# EAGLE design Uncertainty Device (EAGLE 9.6.2)

## Sheet 1 of 2
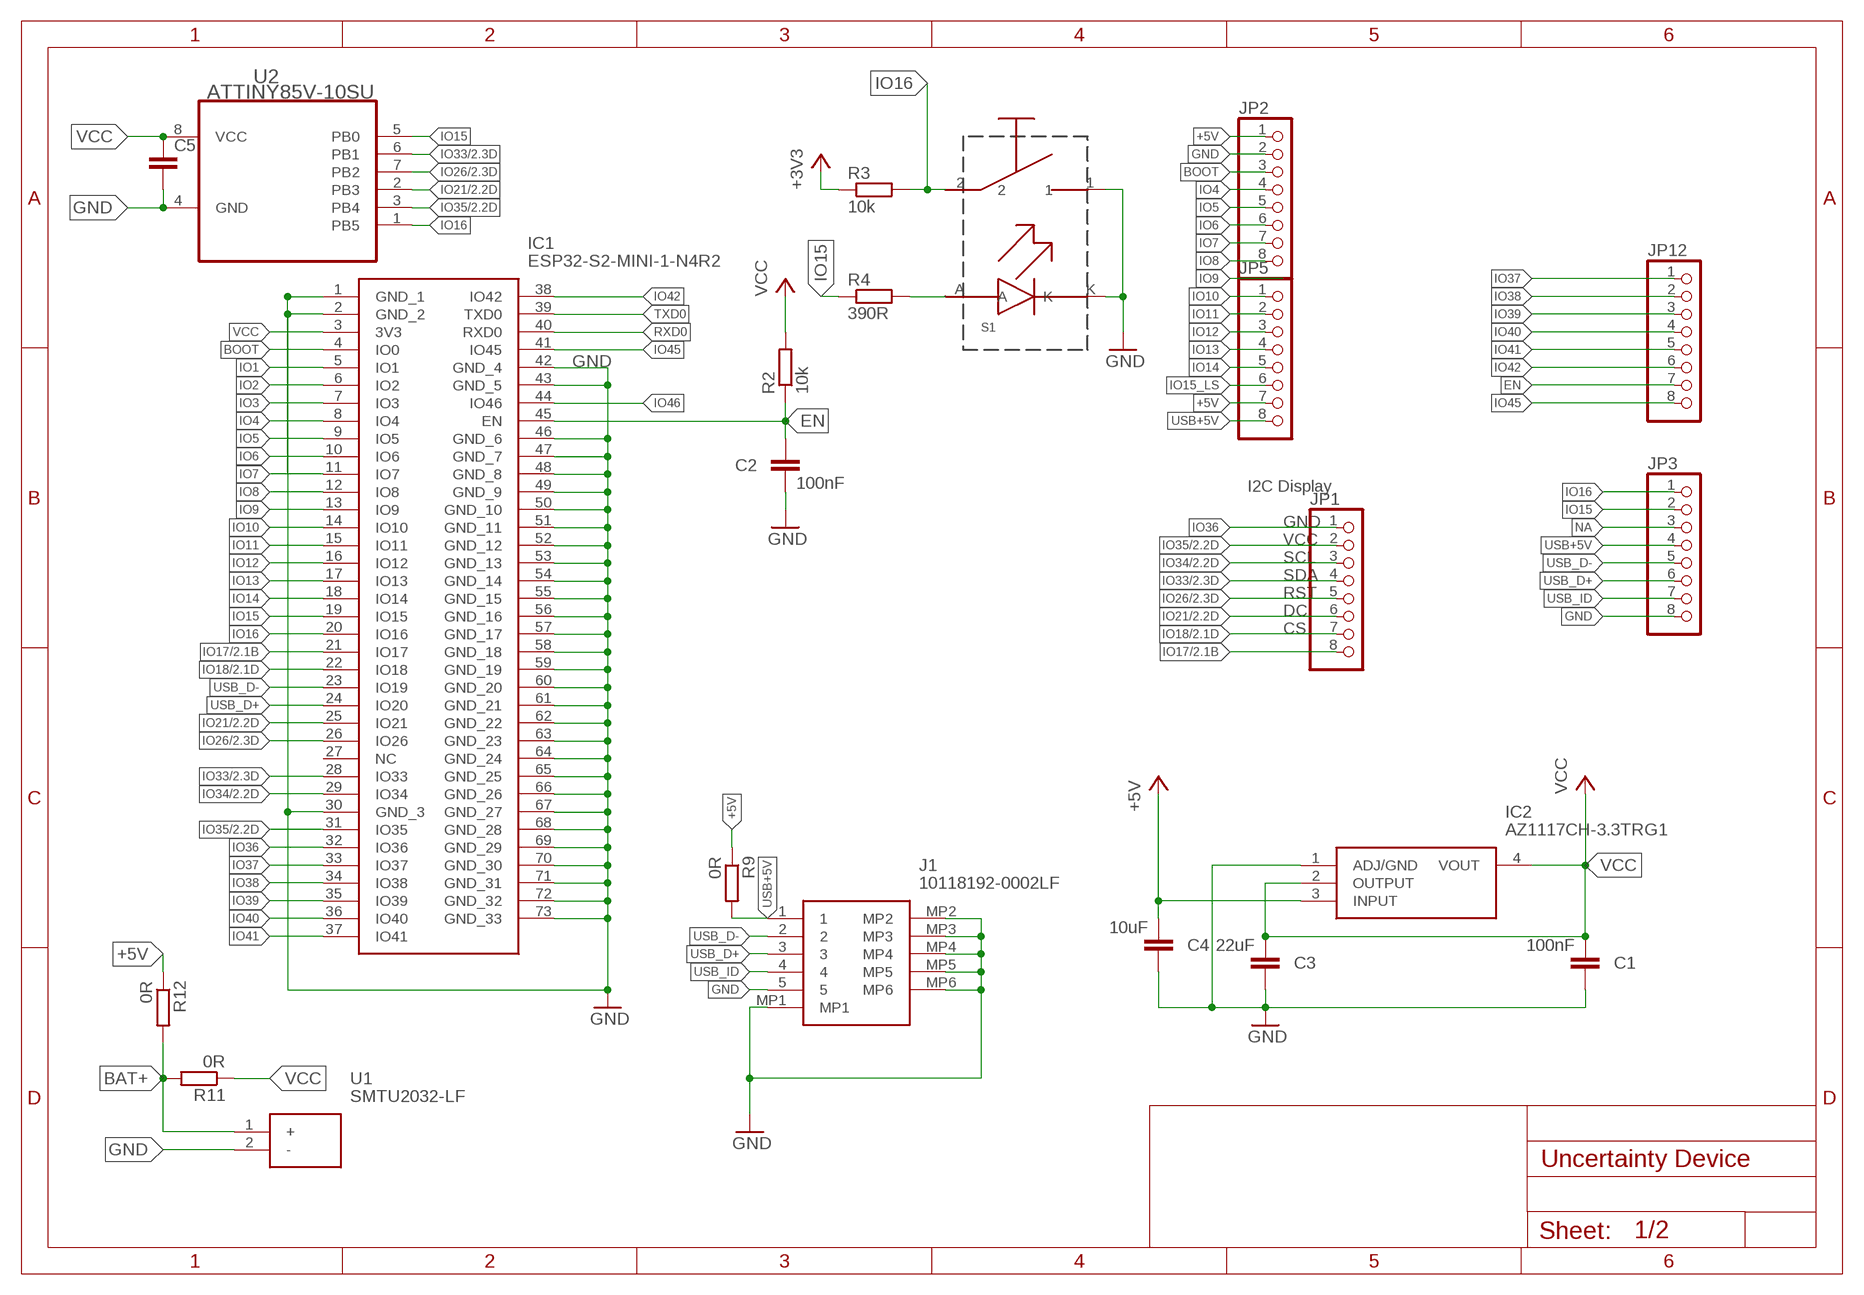
[diagram p0: schematic, sheet 1]

### Parts
C1  100nF  C-EUC0805  [C0805]
C2  100nF  C-EUC0805  [C0805]
C3  22uF  C-EUC0805  [C0805]
C4  10uF  C-EUC0805  [C0805]
C5  C-EUC0805  [C0805]
IC1  ESP32-S2-MINI-1-N4R2  [ESP32S2MINI1N4R2]
IC2  AZ1117CH-3.3TRG1  [SOT230P700X180-4N]
J1  10118192-0002LF  [101181920002LF]
JP1  PINHD-1X8  [1X08]
JP2  PINHD-1X8  [1X08]
JP3  PINHD-1X8  [1X08]
JP5  PINHD-1X8  [1X08]
JP12  PINHD-1X8  [1X08]
R2  10k  R-EU_R0805  [R0805]
R3  10k  R-EU_R0805  [R0805]
R4  390R  R-EU_R0805  [R0805]
R9  0R  R-EU_R0805  [R0805]
R11  0R  R-EU_R0805  [R0805]
R12  0R  R-EU_R0805  [R0805]
S1  3006SMD  [SMD]
U1  SMTU2032-LF  [SMTU2032LF]
U2  ATTINY85V-10SU  [SOIC127P798X216-8N]

### Nets
+3V3: R3.1
+5V: C4.2 IC2.3(INPUT) JP2.1 JP5.7 R9.1 R12.1
BAT+: R11.2 R12.2 U1.1(+)
BOOT: IC1.4(IO0) JP2.3
EN: C2.1 IC1.45(EN) JP12.7 R2.1
GND: C1.1 C2.2 C3.1 C4.1 C5.2 IC1.1(GND_1) IC1.2(GND_2) IC1.30(GND_3) IC1.42(GND_4) IC1.43(GND_5) IC1.46(GND_6) IC1.47(GND_7) IC1.48(GND_8) IC1.49(GND_9) IC1.50(GND_10) IC1.51(GND_11) IC1.52(GND_12) IC1.53(GND_13) IC1.54(GND_14) IC1.55(GND_15) IC1.56(GND_16) IC1.57(GND_17) IC1.58(GND_18) IC1.59(GND_19) IC1.60(GND_20) IC1.61(GND_21) IC1.62(GND_22) IC1.63(GND_23) IC1.64(GND_24) IC1.65(GND_25) IC1.66(GND_26) IC1.67(GND_27) IC1.68(GND_28) IC1.69(GND_29) IC1.70(GND_30) IC1.71(GND_31) IC1.72(GND_32) IC1.73(GND_33) IC2.1(ADJ/GND) J1.5 J1.MP1 J1.MP2 J1.MP3 J1.MP4 J1.MP5 J1.MP6 JP2.2 JP3.8 S1.1 S1.K U1.2(-) U2.4(GND) ; also sheet 2
IO1: IC1.5(IO1)
IO2: IC1.6(IO2)
IO3: IC1.7(IO3)
IO4: IC1.8(IO4) JP2.4
IO5: IC1.9(IO5) JP2.5
IO6: IC1.10(IO6) JP2.6
IO7: IC1.11(IO7) JP2.7
IO8: IC1.12(IO8) JP2.8
IO9: IC1.13(IO9)
IO10: IC1.14(IO10) JP5.1
IO11: IC1.15(IO11) JP5.2
IO12: IC1.16(IO12) JP5.3
IO13: IC1.17(IO13) JP5.4
IO14: IC1.18(IO14) JP5.5
IO15: IC1.19(IO15) JP3.2 R4.1 U2.5(PB0)
IO15_LS: JP5.6
IO16: IC1.20(IO16) JP3.1 R3.2 S1.2 U2.1(PB5)
IO17: IC1.21(IO17) JP1.8 ; also sheet 2
IO18: IC1.22(IO18) JP1.7 ; also sheet 2
IO21: IC1.25(IO21) JP1.6 U2.2(PB3) ; also sheet 2
IO26: IC1.26(IO26) JP1.5 U2.7(PB2) ; also sheet 2
IO33: IC1.28(IO33) JP1.4 U2.6(PB1) ; also sheet 2
IO34: IC1.29(IO34) JP1.3 ; also sheet 2
IO35: IC1.31(IO35) JP1.2 U2.3(PB4) ; also sheet 2
IO36: IC1.32(IO36) JP1.1
IO37: IC1.33(IO37) JP12.1
IO38: IC1.34(IO38) JP12.2
IO39: IC1.35(IO39) JP12.3
IO40: IC1.36(IO40) JP12.4
IO41: IC1.37(IO41) JP12.5
IO42: IC1.38(IO42) JP12.6
IO45: IC1.41(IO45) JP12.8
IO46: IC1.44(IO46)
N$5: R4.2 S1.A
NA: JP3.3
RXD0: IC1.40(RXD0)
TXD0: IC1.39(TXD0)
USB+5V: J1.1 JP3.4 JP5.8 R9.2
USB_D+: IC1.24(IO20) J1.3 JP3.6
USB_D-: IC1.23(IO19) J1.2 JP3.5
USB_ID: J1.4 JP3.7
VCC: C1.2 C3.2 C5.1 IC1.3(3V3) IC2.2(OUTPUT) IC2.4(VOUT) R2.2 R11.1 U2.8(VCC)
Unconnected: IC1.27(NC)

### Notes on the sheet
- I2C Display
- GND
- VCC
- SCL
- SDA
- RST
- DC
- CS

## Sheet 2 of 2
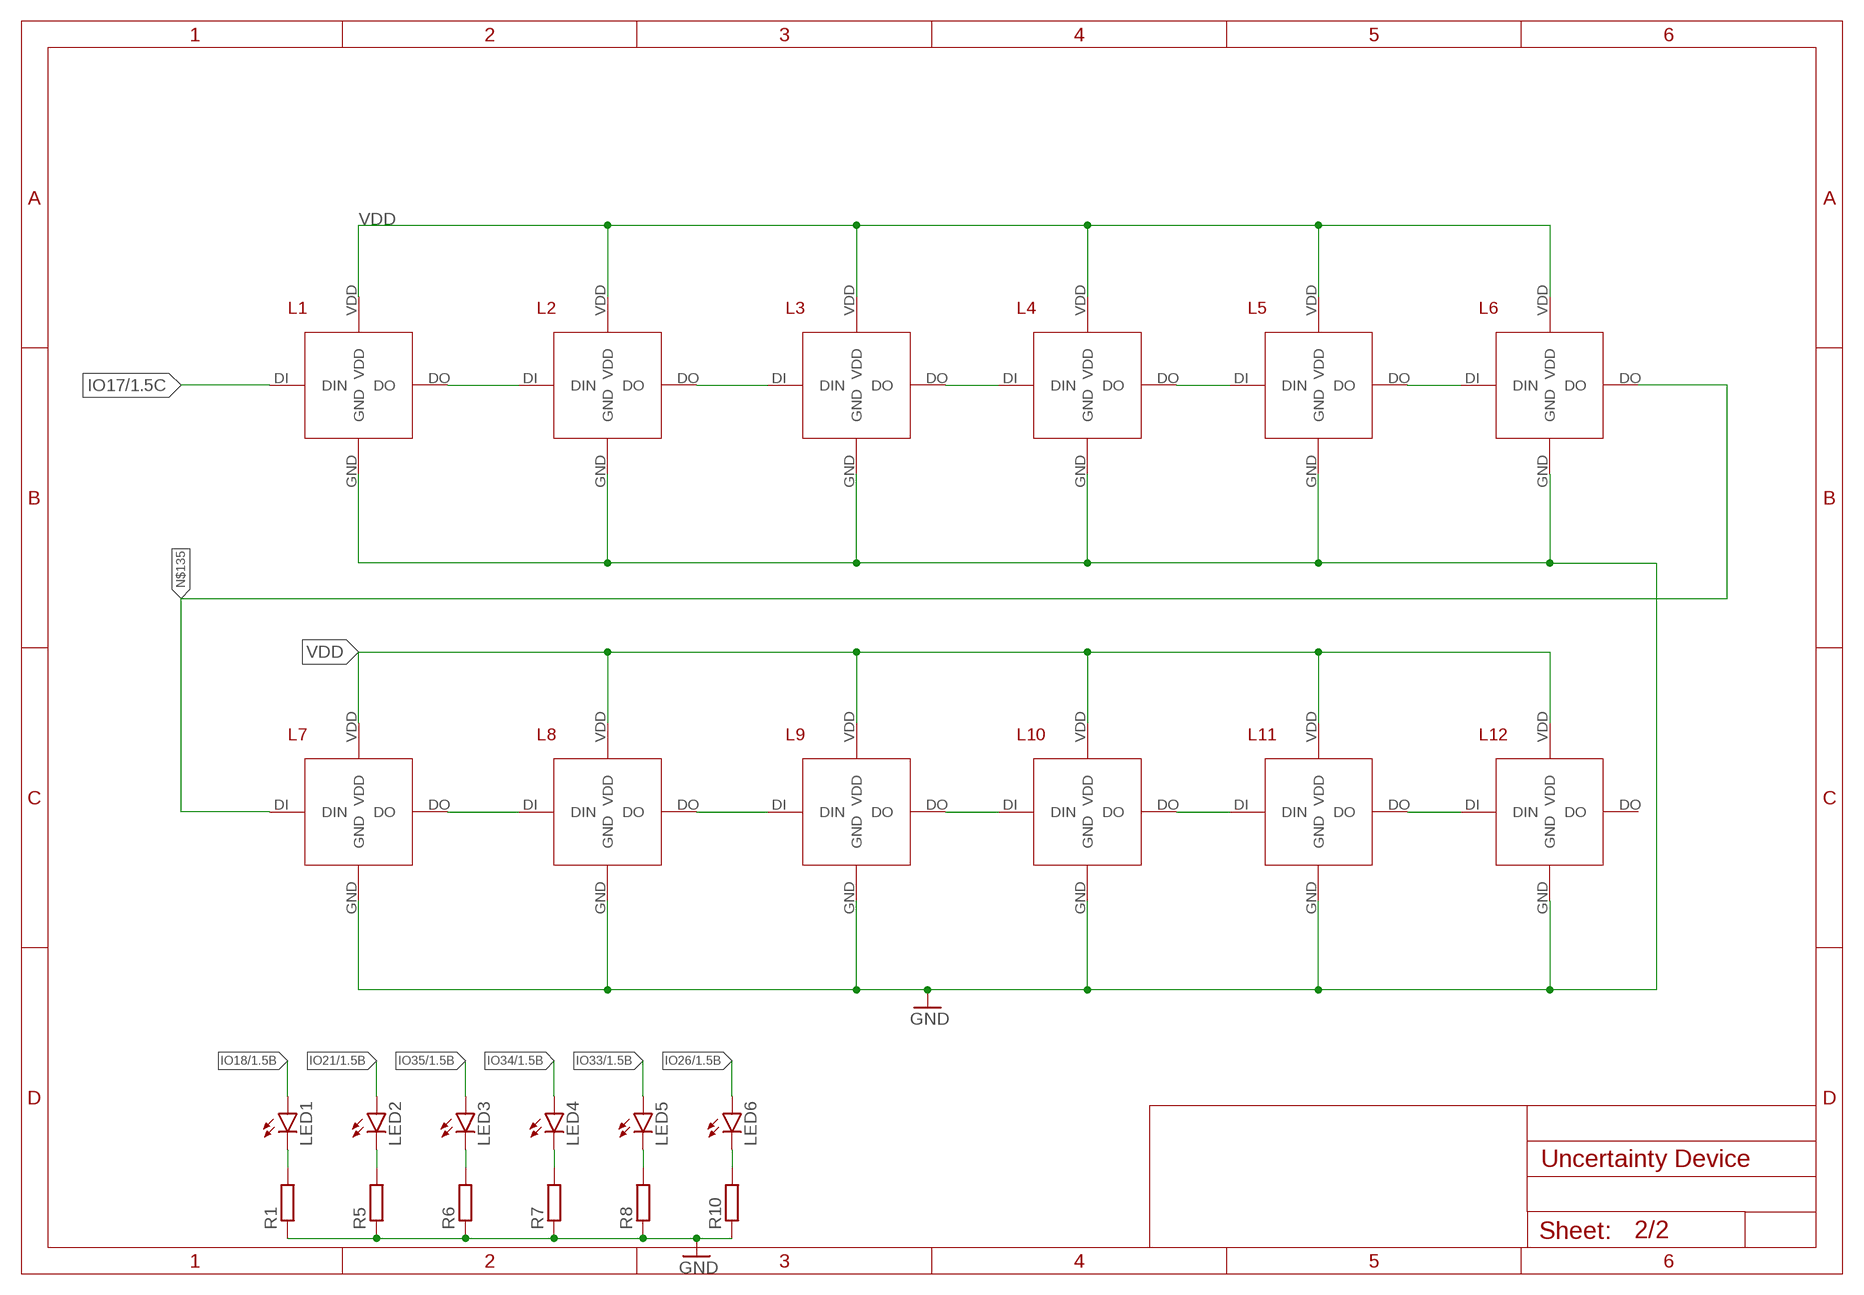
[diagram p1: schematic, sheet 2]

### Parts
L1  XL-1615RGBC  [XL-1615RGBC-WS2812]
L2  XL-1615RGBC  [XL-1615RGBC-WS2812]
L3  XL-1615RGBC  [XL-1615RGBC-WS2812]
L4  XL-1615RGBC  [XL-1615RGBC-WS2812]
L5  XL-1615RGBC  [XL-1615RGBC-WS2812]
L6  XL-1615RGBC  [XL-1615RGBC-WS2812]
L7  XL-1615RGBC  [XL-1615RGBC-WS2812]
L8  XL-1615RGBC  [XL-1615RGBC-WS2812]
L9  XL-1615RGBC  [XL-1615RGBC-WS2812]
L10  XL-1615RGBC  [XL-1615RGBC-WS2812]
L11  XL-1615RGBC  [XL-1615RGBC-WS2812]
L12  XL-1615RGBC  [XL-1615RGBC-WS2812]
LED1  LEDCHIPLED_0805  [CHIPLED_0805]
LED2  LEDCHIPLED_0805  [CHIPLED_0805]
LED3  LEDCHIPLED_0805  [CHIPLED_0805]
LED4  LEDCHIPLED_0805  [CHIPLED_0805]
LED5  LEDCHIPLED_0805  [CHIPLED_0805]
LED6  LEDCHIPLED_0805  [CHIPLED_0805]
R1  R-EU_R0805  [R0805]
R5  R-EU_R0805  [R0805]
R6  R-EU_R0805  [R0805]
R7  R-EU_R0805  [R0805]
R8  R-EU_R0805  [R0805]
R10  R-EU_R0805  [R0805]

### Nets
GND: L1.GND L2.GND L3.GND L4.GND L5.GND L6.GND L7.GND L8.GND L9.GND L10.GND L11.GND L12.GND R1.1 R5.1 R6.1 R7.1 R8.1 R10.1 ; also sheet 1
IO17: L1.DI(DIN) ; also sheet 1
IO18: LED1.A ; also sheet 1
IO21: LED2.A ; also sheet 1
IO26: LED6.A ; also sheet 1
IO33: LED5.A ; also sheet 1
IO34: LED4.A ; also sheet 1
IO35: LED3.A ; also sheet 1
N$3: LED1.C R1.2
N$8: L1.DO L2.DI(DIN)
N$9: L2.DO L3.DI(DIN)
N$10: L3.DO L4.DI(DIN)
N$11: L4.DO L5.DI(DIN)
N$12: L5.DO L6.DI(DIN)
N$16: L7.DO L8.DI(DIN)
N$17: L8.DO L9.DI(DIN)
N$18: L9.DO L10.DI(DIN)
N$19: L10.DO L11.DI(DIN)
N$20: L11.DO L12.DI(DIN)
N$21: LED2.C R5.2
N$22: LED3.C R6.2
N$23: LED4.C R7.2
N$24: LED5.C R8.2
N$25: LED6.C R10.2
N$135: L6.DO L7.DI(DIN)
VDD: L1.VDD L2.VDD L3.VDD L4.VDD L5.VDD L6.VDD L7.VDD L8.VDD L9.VDD L10.VDD L11.VDD L12.VDD
Unconnected: L12.DO

## Library data of the parts
C1-C4 = rcl:C-EU: CAPACITOR, European symbol; SPICEPREFIX: C
C5 = resistor:C-EU: CAPACITOR, European symbol
IC1 = ESP32-S2-MINI-1-N4R2:ESP32-S2-MINI-1-N4R2: WiFi Modules - 802.11 SMD module, ESP32-S2FN4R2 with 4 MB flash die and 2 MB PSRAM die inside, PCB antenna Source: Datasheet; DESCRIPTION: WiFi Modules - 802.11 SMD module, ESP32-S2FN4R2 with 4 MB flash die and 2 MB PSRAM die inside, PCB antenna; HEIGHT: mm; MANUFACTURER_NAME: Espressif Systems; MANUFACTURER_PART_NUMBER: ESP32-S2-MINI-1-N4R2; MOUSER_PART_NUMBER: 356-ESP32S2MINI1N4R2; MOUSER_PRICE-STOCK: https://www.mouser.co.uk/ProductDetail/Espressif-Systems/ESP32-S2-MINI-1-N4R2?qs=iLbezkQI%252Bsgb61FCBnw%252B9A%3D%3D
IC2 = AZ1117CH-3.3TRG1:AZ1117CH-3.3TRG1: 1.35A 3.3V LDO Reg. Current Limit SOT223 DiodesZetex AZ1117CH-3.3TRG1, LDO Voltage Regulator, 0.8A, 3.3 V +/-1%, maximum of 15 Vin, 3-Pin SOT-223 Source: Datasheet <https://www.diodes.com//assets/Datasheets/AZ1117C.pdf>; DESCRIPTION: 1.35A 3.3V LDO Reg. Current Limit SOT223 DiodesZetex AZ1117CH-3.3TRG1, LDO Voltage Regulator, 0.8A, 3.3 V +/-1%, maximum of 15 Vin, 3-Pin SOT-223; HEIGHT: 1.8mm; MANUFACTURER_NAME: Diodes Incorporated; MANUFACTURER_PART_NUMBER: AZ1117CH-3.3TRG1; MOUSER_PART_NUMBER: 621-AZ1117CH-3.3TRG1; MOUSER_PRICE-STOCK: https://www.mouser.co.uk/ProductDetail/Diodes-Incorporated/AZ1117CH-3.3TRG1?qs=FKu9oBikfSm7ntaG6olPSQ%3D%3D
J1 = 10118192-0002LF:10118192-0002LF: Micro USB 2.0, Input Output Connectors, B TYPE RECEPTACLE without flange Source: Datasheet <https://cdn.amphenol-cs.com/media/wysiwyg/files/drawing/10118192.pdf>; DESCRIPTION: Micro USB 2.0, Input Output Connectors, B TYPE RECEPTACLE without flange; HEIGHT: 3.08mm; MANUFACTURER_NAME: Amphenol Communications Solutions; MANUFACTURER_PART_NUMBER: 10118192-0002LF
JP1-JP3 JP5 JP12 = pinhead:PINHD-1X8: PIN HEADER
L1-L12 = Xinglight:XL-1615RGBC
LED1-LED6 = led:LED: LED OSRAM: - CHIPLED LG R971, LG N971, LY N971, LG Q971, LY Q971, LO R971, LY R971 LH N974, LH R974 LS Q976, LO Q976, LY Q976 LO Q996 - Hyper CHIPLED LW Q18S LB Q993, LB Q99A, LB R99A - SideLED LS A670, LO A670, LY A670, LG A670, LP A670 LB A673, LV A673, LT A673, LW A673 LH A674 LY A675 LS A676, LA A676, LO A676, LY A676, LW A676 LS A679, LY A679, LG A679 - Hyper Micro SIDELED® LS Y876, LA Y876, LO Y876, LY Y876 LT Y87S - SmartLED LW L88C, LW L88S LB L89C, LB L89S, LG L890 LS L89K, LO L89K, LY L89K LS L896, LA L896, LO L896, LY L896 - TOPLED LS T670, LO T670, LY T670, LG T670, LP T670 LSG T670, LSP T670, LSY T670, LOP T670, LYG T670 LG T671, LOG T671, LSG T671 LB T673, LV T673, LT T673, LW T673 LH T674 LS T676, LA T676, LO T676, LY T676, LB T676, LH T676, LSB T676, LW T676 LB T67C, LV T67C, LT T67C, LS T67K, LO T67K, LY T67K, LW E67C LS E67B, LA E67B, LO E67B, LY E67B, LB E67C, LV E67C, LT E67C LW T67C LS T679, LY T679, LG T679 LS T770, LO T770, LY T770, LG T770, LP T770 LB T773, LV T773, LT T773, LW T773 LH T774 LS E675, LA E675, LY E675, LS T675 LS T776, LA T776, LO T776, LY T776, LB T776 LHGB T686 LT T68C, LB T68C - Hyper Mini TOPLED® LB M676 - Mini TOPLED Santana® LG M470 LS M47K, LO M47K, LY M47K Source: http://www.osram.convergy.de LUXEON: - LUMILED® LXK2-PW12-R00, LXK2-PW12-S00, LXK2-PW14-U00, LXK2-PW14-V00 LXK2-PM12-R00, LXK2-PM12-S00, LXK2-PM14-U00 LXK2-PE12-Q00, LXK2-PE12-R00, LXK2-PE12-S00, LXK2-PE14-T00, LXK2-PE14-U00 LXK2-PB12-K00, LXK2-PB12-L00, LXK2-PB12-M00, LXK2-PB14-N00, LXK2-PB14-P00, LXK2-PB14-Q00 LXK2-PR12-L00, LXK2-PR12-M00, LXK2-PR14-Q00, LXK2-PR14-R00 LXK2-PD12-Q00, LXK2-PD12-R00, LXK2-PD12-S00 LXK2-PH12-R00, LXK2-PH12-S00 LXK2-PL12-P00, LXK2-PL12-Q00, LXK2-PL12-R00 Source: www.luxeon.com KINGBRIGHT: KA-3528ASYC Source: www.kingbright.com
R1-R12 = rcl:R-EU_: RESISTOR, European symbol; SPICEPREFIX: R
S1 = smd:3006SMD
U1 = SMTU2032-LF:SMTU2032-LF: Coin Cell Battery Holders SFC MNT FOR CR2032 Source: Datasheet <https://componentsearchengine.com/Datasheets/1/SMTU2032-LF.pdf>; DESCRIPTION: Coin Cell Battery Holders SFC MNT FOR CR2032; HEIGHT: 5mm; MANUFACTURER_NAME: RENATA; MANUFACTURER_PART_NUMBER: SMTU2032-LF; MOUSER_PART_NUMBER: 614-SMTU2032-LF; MOUSER_PRICE-STOCK: https://www.mouser.co.uk/ProductDetail/Renata/SMTU2032-LF?qs=r1PAtlylphCLeXbokB9Tog%3D%3D
U2 = Attiny85V:ATTINY85V-10SU: 8-bit Microcontroller with In-System Programmable Flash; MPN: ATTINY85V-10SU; OC_FARNELL: 1455166; OC_NEWARK: 68T3816; PACKAGE: SOIC-8; SUPPLIER: Atmel

## Board
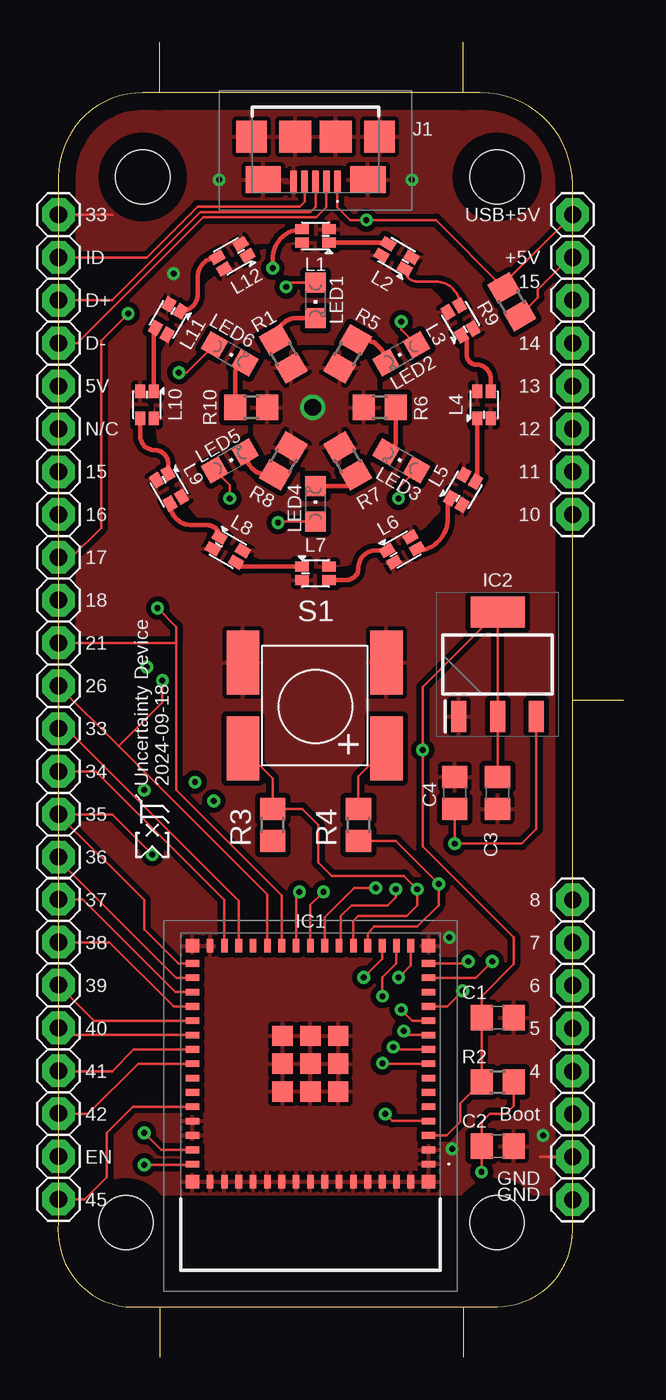
[diagram p2: board, top side]
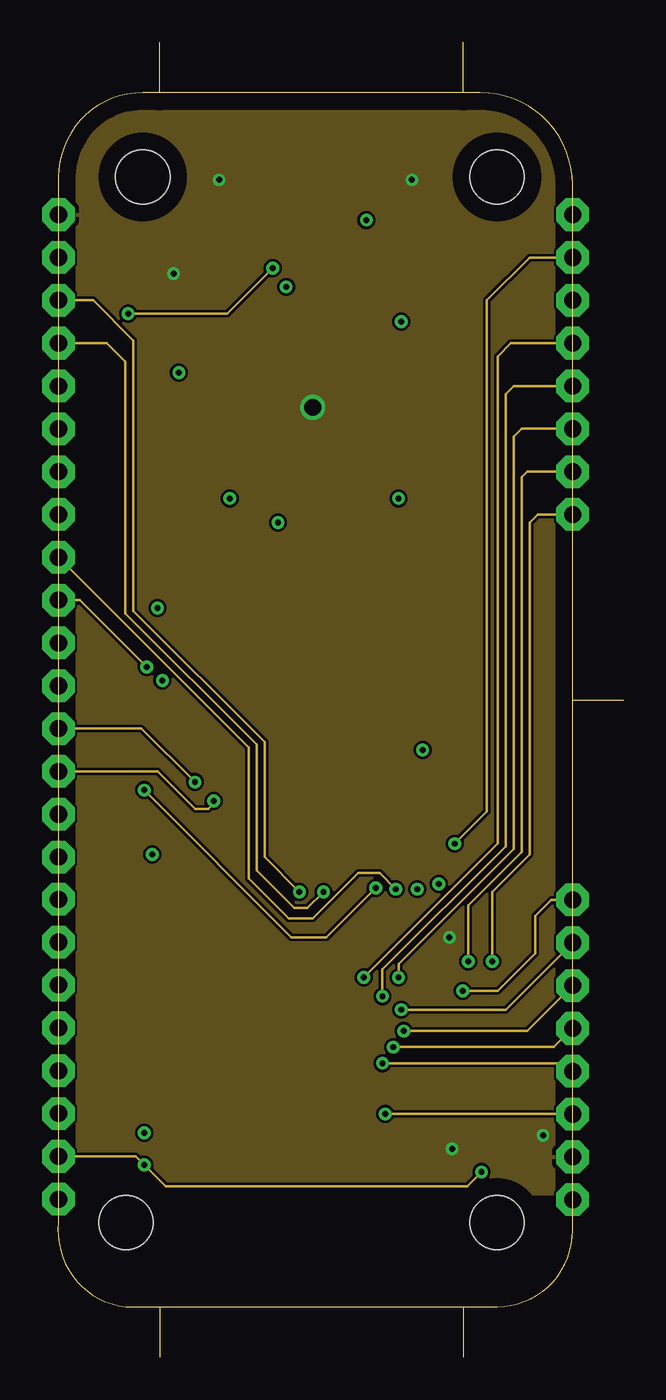
[diagram p3: board, inner layer Route2]
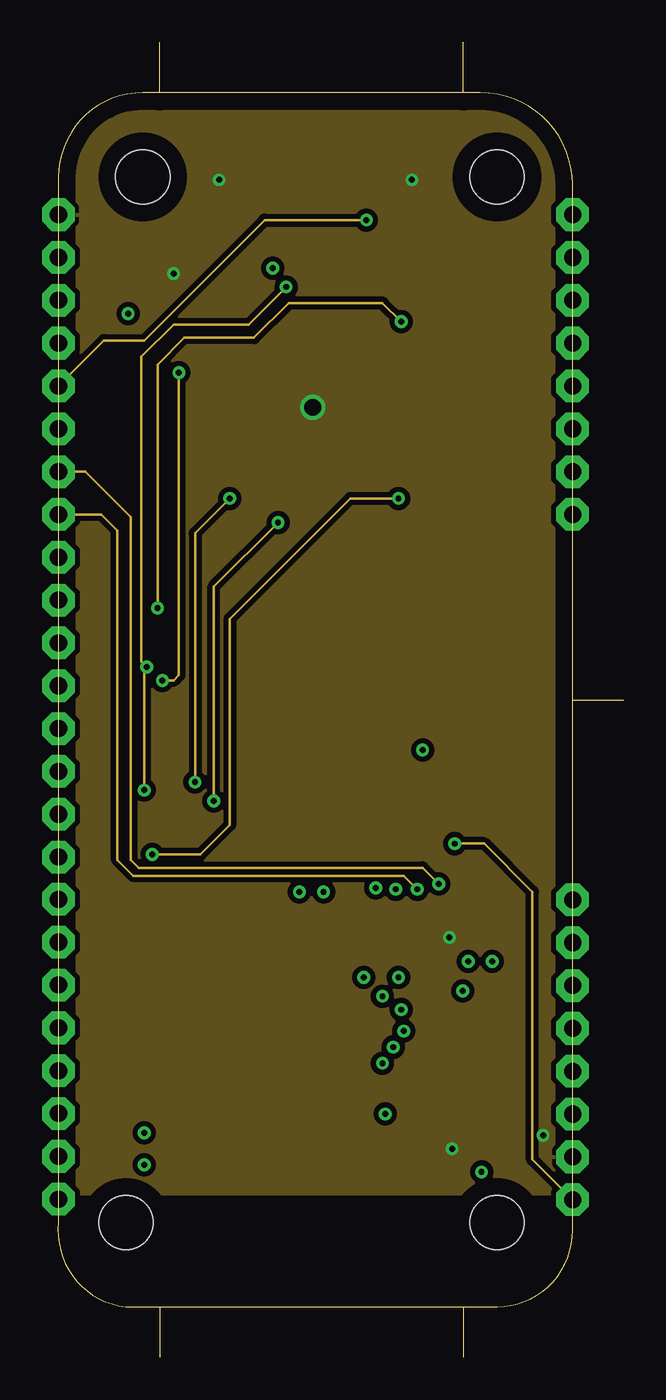
[diagram p4: board, inner layer Route15]
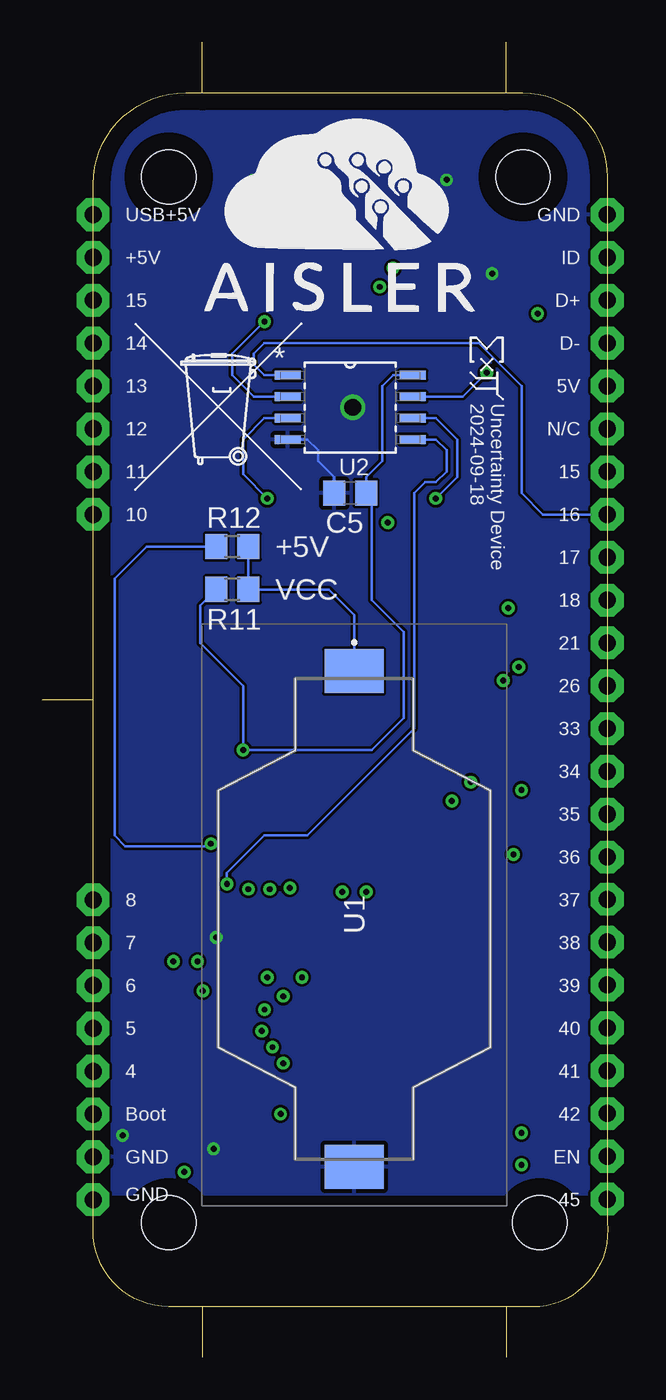
[diagram p5: board, bottom side, seen from below]

Size 33.53 x 78 mm. Coordinates in mm from the lower left corner, seen from the top.
Outline: 6.03,3 4.03,3 arc-90 0.03,8 0.03,70 arc-90 5.03,75 6.03,75
Outline: 6.03,3 24.03,3
Outline: 24.03,3 26.03,3 arc90 30.51,7.54 30.51,69.58 arc90 25.03,75 24.03,75
Outline: 24.03,75 6.03,75
Outline: 6.03,75 6.03,78
Outline: 24.03,75 24.03,78
Outline: 6.03,3 6.03,0
Outline: 24.03,3 24.03,0
Outline: 30.53,39 33.53,39
Copper layers (1+2*15+16): Top 0.04mm / dielectric 0.138mm / Route2 0.035mm / dielectric 0.36mm / Route15 0.035mm / dielectric 0.138mm / Bottom 0.04mm
Design rules "default *": minimum track width 6mil, minimum drill 0.35mm, track to track 6mil, track to pad 6mil, pad to pad 6mil, via to via 6mil, smd to smd 6mil, copper to edge 40mil, drill to drill 6mil, minimum pad ring 10mil, minimum via ring 8mil, stop-mask expansion 0mil, vias tented up to drill 14mil, thermal gap 10mil
Holes 3.2 mm at 26.03,8 4.03,8 5.03,70 26.03,70
tKeepout: area 2,67 to 8,73; area 23,67 to 29,73

### Footprints (pad centres in the part's own frame; a part is rotated, then mirrored left to right if it is on the bottom)
C0805 = smd 1.3 x 1.5: 1 -0.95,0; 2 0.95,0
ESP32S2MINI1N4R2 = smd 0.8 x 0.4: 1 -7,5.95; 2 -7,5.1; 3 -7,4.25; 4 -7,3.4; 5 -7,2.55; 6 -7,1.7; 7 -7,0.85; 8 -7,0; 9 -7,-0.85; 10 -7,-1.7; 11 -7,-2.55; 12 -7,-3.4; 13 -7,-4.25; 14 -7,-5.1; 15 -7,-5.95; 31 7,-5.95; 32 7,-5.1; 33 7,-4.25; 34 7,-3.4; 35 7,-2.55; 36 7,-1.7; 37 7,-0.85; 38 7,0; 39 7,0.85; 40 7,1.7; 41 7,2.55; 42 7,3.4; 43 7,4.25; 44 7,5.1; 45 7,5.95 | smd 0.4 x 0.8: 16 -5.95,-7; 17 -5.1,-7; 18 -4.25,-7; 19 -3.4,-7; 20 -2.55,-7; 21 -1.7,-7; 22 -0.85,-7; 23 0,-7; 24 0.85,-7; 25 1.7,-7; 26 2.55,-7; 27 3.4,-7; 28 4.25,-7; 29 5.1,-7; 30 5.95,-7; 46 5.95,7; 47 5.1,7; 48 4.25,7; 49 3.4,7; 50 2.55,7; 51 1.7,7; 52 0.85,7; 53 0,7; 54 -0.85,7; 55 -1.7,7; 56 -2.55,7; 57 -3.4,7; 58 -4.25,7; 59 -5.1,7; 60 -5.95,7 | smd 1.2 x 1.2: 61 0,0; 66 -1.65,1.65; 67 -1.65,0; 68 -1.65,-1.65; 69 0,-1.65; 70 1.65,-1.65; 71 1.65,0; 72 1.65,1.65; 73 0,1.65 | smd 0.8 x 0.8: 62 -7,7; 63 -7,-7; 64 7,-7; 65 7,7
SOT230P700X180-4N = smd 1.85 x 0.9: 1 -3.1,2.3; 2 -3.1,0; 3 -3.1,-2.3 | smd 1.85 x 3.2: 4 3.1,0
101181920002LF = smd 0.4 x 1.35: 1 -1.3,1.875; 2 -0.65,1.875; 3 0,1.875; 4 0.65,1.875; 5 1.3,1.875 | smd 2.1 x 1.6: MP1 -3.1,1.75; MP2 3.1,1.75 | smd 1.8 x 1.9: MP3 -3.8,-0.8; MP6 3.8,-0.8 | smd 1.9 x 1.9: MP4 -1.2,-0.8; MP5 1.2,-0.8
1X08 = drill 1.016 pad 1.93 octagon: 1 -8.89,0; 2 -6.35,0; 3 -3.81,0; 4 -1.27,0; 5 1.27,0; 6 3.81,0; 7 6.35,0; 8 8.89,0
XL-1615RGBC-WS2812 = smd 0.8 x 0.6: DI 0.8,-0.4; DO -0.8,0.4; GND -0.8,-0.4; VDD 0.8,0.4
CHIPLED_0805 = smd 1.2 x 1.2: A 0,-1.05; C 0,1.05
R0805 = smd 1.3 x 1.5: 1 -0.95,0; 2 0.95,0
SMD = smd 3.81 x 1.93: 1 2.644,-4.199; 2 -2.456,4.301; A -2.456,-4.199; K 2.644,4.301
SMTU2032LF = smd 2.6 x 3.5: 1 -14.7,0; 2 14.7,0
SOIC127P798X216-8N = smd 1.549 x 0.533: 1 -3.708,1.905; 2 -3.708,0.635; 3 -3.708,-0.635; 4 -3.708,-1.905; 5 3.708,-1.905; 6 3.708,-0.635; 7 3.708,0.635; 8 3.708,1.905

### Placement (x,y rotation side)
C1  26.06,20.14 180 top
C2  26.06,12.53 0 top
C3  26.06,33.48 90 top
C4  23.52,33.48 270 top
C5  15.27,51.26 180 bottom
IC1  14.97,17.41 180 top
IC2  26.06,41.1 90 top
J1  15.27,71.58 180 top
JP1  0.03,38.56 90 top
JP2  30.51,18.24 90 top
JP3  0.03,58.88 90 top
JP5  30.51,58.88 90 top
JP12  0.03,18.27 270 top
L1  15.27,66.5 180 top
L2  20.07,65.3 150 top
L3  23.87,61.5 120 top
L4  25.27,56.5 90 top
L5  24.02,51.45 60 top
L6  20.41,47.91 30 top
L7  15.27,46.5 0 top
L8  10.07,47.9 330 top
L9  6.59,51.53 300 top
L10  5.27,56.5 270 top
L11  6.53,61.55 240 top
L12  10.34,65.29 210 top
LED1  15.27,62.69 180 top
LED2  20.35,59.52 120 top
LED3  20.35,53.16 60 top
LED4  15.27,50.62 0 top
LED5  10.19,53.16 300 top
LED6  10.19,59.52 240 top
R1  13.36,59.52 120 top
R2  26.06,16.34 180 top
R3  12.73,31.57 90 top
R4  17.81,31.57 90 top
R5  17.17,59.52 60 top
R6  19.08,56.34 0 top
R7  17.17,53.16 300 top
R8  13.36,53.16 240 top
R9  26.89,62.6 120 top
R10  11.46,56.34 180 top
R11  22.25,45.55 0 bottom
R12  22.25,48.09 0 bottom
S1  15.27,38.56 90 top
U1  15.03,26 270 bottom
U2  15.27,56.34 0 bottom
U$1  [AISLER]  16.19,66.68 0 bottom
U$3  [TONNE_10.00]  23.19,54.4 0 bottom

### Tracks (layer width: path | path; a pad name or v marks a point on that pad's centre or on a via)
+5V  (via drill 0.35)
  Top 0.152: R9.1 28.44,62.85 28.44,63.33 30.35,65.23 JP5.7 | IC2.3 28.36,31.34 27.49,30.46 v23.52,30.46 C4.2
  Route2 0.152: JP5.7 27.97,65.23 25.43,62.69 25.43,32.37 v23.52,30.46
  Route15 0.152: JP2.1 28.13,11.73 28.13,27.61 25.27,30.46 v23.52,30.46
  Bottom 0.152: R12.1 27.33,48.09 29.24,46.18 29.24,30.94 28.6,30.3 23.68,30.3 v23.52,30.46
BAT+
  Bottom 0.152: R12.2 R11.2 16.54,45.55 15.03,44.03 U1.1
BOOT  (via drill 0.35)
  Top 0.152: IC1.4 19.81,14.01 v19.39,14.43
  Route2 0.152: v19.39,14.43 JP2.3
EN  (via drill 0.35)
  Top 0.152: R2.1 27.01,14.91 26.54,14.43 25.59,14.43 25.11,13.96 C2.1 25.11,10.94 v25.11,10.99 | v5.11,11.41 7.92,11.41 IC1.45
  Route2 0.152: v25.11,10.99 24.26,10.14 6.38,10.14 v5.11,11.41 4.6,11.92 JP12.7
GND  (via drill 0.35, 1)
  Top 0.152: JP3.8 3.2,67.77 | JP2.2 28.6,11.89
  Bottom 0.152: U2.4 17.81,54.44 17.17,53.8 17.17,53.16 16.22,52.21 C5.2
  other vias: 15.11,56.34 6.85,64.28 9.55,69.83 20.98,69.83 23.36,12.37 28.76,13.16 23.2,24.91
  pour Top (isolate 0.305, rank 5): -0.13,9.68 -0.13,75.78 30.99,75.78 30.99,9.68
  pour Bottom: -0.13,9.68 -0.13,75.78 30.99,75.78 30.99,9.68
  pour Route2: -0.13,9.68 -0.13,75.78 30.99,75.78 30.99,9.68
  pour Top: 15.27,59.67 15.74,59.67 arc-90 19.08,56.34 arc-90 15.58,52.85 15.27,52.85 14.95,52.85 arc-90 11.46,56.34 arc-90 14.79,59.67
  pour Route15 (isolate 0.305): -0.13,9.68 -0.13,75.78 30.99,75.78 30.99,9.68
IO4  (via drill 0.35)
  Top 0.152: IC1.8 19.27,17.41 v19.24,17.45
  Route2 0.152: v19.24,17.45 30.03,17.45 JP2.4
IO5  (via drill 0.35)
  Top 0.152: IC1.9 20.01,18.26 v19.87,18.4
  Route2 0.152: v19.87,18.4 29.4,18.4 JP2.5
IO6  (via drill 0.35)
  Top 0.152: IC1.10 20.74,19.11 v20.51,19.35
  Route2 0.152: v20.51,19.35 27.81,19.35 JP2.6
IO7  (via drill 0.35)
  Top 0.152: IC1.11 21,19.96 v20.35,20.62
  Route2 0.152: v20.35,20.62 26.54,20.62 JP2.7
IO8  (via drill 0.35)
  Top 0.152: IC1.12 23.08,20.81 v24,21.73
  Route2 0.152: JP2.8 29.24,27.13 28.28,26.18 28.28,23.95 26.06,21.73 v24,21.73
IO10  (via drill 0.35)
  Top 0.152: IC1.14 24.78,22.51 v25.74,23.48
  Route2 0.152: v25.74,23.48 25.74,27.61 27.97,29.83 27.97,49.51 28.44,49.99 JP5.1
IO11  (via drill 0.35)
  Top 0.152: IC1.15 24.2,23.36 v24.32,23.48
  Route2 0.152: JP5.2 27.81,52.53 27.49,52.21 27.49,29.99 24.32,26.81 v24.32,23.48
IO12  (via drill 0.35)
  Top 0.152: IC1.16 20.92,23.25 v20.19,22.53
  Route2 0.152: v20.19,22.53 20.19,23.32 27.01,30.15 27.01,54.59 27.49,55.07 JP5.3
IO13  (via drill 0.35)
  Top 0.152: v19.24,21.41 19.24,22.53 20.07,23.36 IC1.17
  Route2 0.152: JP5.4 27.01,57.61 26.54,57.13 26.54,30.3 19.24,23 v19.24,21.41
IO14  (via drill 0.35)
  Top 0.152: IC1.18 19.22,23.62 v18.12,22.53
  Route2 0.152: v18.12,22.53 26.06,30.46 26.06,59.36 26.86,60.15 JP5.5
IO15  (via drill 0.35)
  Top 0.152: IC1.19 18.37,25.15 18.76,25.54 21.3,25.54 22.57,26.81 v22.57,28.08 20.03,30.62 R4.1
  Route15 0.152: JP3.2 1.61,52.53 4.31,49.83 4.31,29.51 4.79,29.04 21.62,29.04 v22.57,28.08
  Bottom 0.152: U2.5 10.19,54.44 9.55,53.8 9.55,52.53 10.19,51.9 10.82,51.9 11.46,51.26 11.46,37.29 17.81,30.94 20.35,30.94 22.57,28.72 v22.57,28.08
IO16  (via drill 0.35)
  Top 0.152: IC1.20 17.52,25.89 17.81,26.18 20.66,26.18 21.3,26.81 v21.3,27.77 20.51,28.56 16.22,28.56 15.43,29.35 15.43,31.57 14.48,32.52 R3.2 12.73,34.34 S1.2
  Route15 0.152: v21.3,27.77 20.51,28.56 4.47,28.56 3.52,29.51 3.52,49.04 2.57,49.99 JP3.1
  Bottom 0.152: JP3.1 3.84,49.99 5.11,51.26 5.11,57.61 7.65,60.15 20.35,60.15 20.98,59.52 20.98,58.88 20.35,58.24 U2.1
IO17  (via drill 0.35)
  Top 0.152: IC1.21 16.77,24.52 16.77,26.18 17.4,26.81 19.55,26.81 20.03,27.29 v20.03,27.77 | v4.15,61.9 2.57,60.31 2.57,49.2 0.82,47.45 JP1.8
  Top 0.254: L1.DI arc90 12.73,65.16 v12.73,64.59
  Route2 0.152: v20.03,27.77 19.08,28.72 17.81,28.72 15.11,26.02 13.68,26.02 11.3,28.4 11.3,36.18 JP1.8 | v12.73,64.59 10.03,61.9 v4.15,61.9
IO18  (via drill 0.35)
  Top 0.152: IC1.22 15.82,26.09 17.57,27.84 v18.84,27.84 | LED1.A 13.78,63.74 v13.52,63.48
  Route2 0.152: v18.84,27.84 15.9,24.91 13.84,24.91 v5.11,33.64 | v5.27,40.94 1.3,44.91 JP1.7
  Route15 0.152: v5.11,33.64 5.11,40.78 v5.27,40.94 4.95,41.26 4.95,59.36 6.85,61.26 11.3,61.26 v13.52,63.48
IO21  (via drill 0.35)
  Top 0.152: IC1.25 13.27,27.38 7.01,33.64 7.01,42.37 | 7.01,42.37 JP1.6 | LED2.A 20.35,60.95 v20.35,61.42 | v5.9,44.43 7.01,43.32 7.01,42.37
  Route15 0.152: v20.35,61.42 19.24,62.53 13.68,62.53 11.62,60.47 7.49,60.47 5.9,58.88 v5.9,44.43
  Bottom 0.152: U2.2 20.98,56.98 22.25,58.24 22.25,59.52 v20.35,61.42
IO26  (via drill 0.35)
  Top 0.152: IC1.26 12.42,27.44 3.6,36.26 | 3.6,36.26 JP1.5 | LED6.A 7.64,58.4 v7.17,58.4 | v6.19,40.15 6.19,38.85 3.6,36.26
  Route15 0.152: v7.17,58.4 7.17,40.47 6.85,40.15 v6.19,40.15
  Bottom 0.152: U2.7 8.6,56.98 v7.17,58.4
IO33  (via drill 0.35)
  Top 0.152: IC1.28 10.72,27.08 0.5,37.29 JP1.4 | LED5.A 10.19,51.73 v10.19,50.94
  Route2 0.152: JP1.4 4.95,37.29 v8.12,34.11
  Route15 0.152: v10.19,50.94 8.12,48.88 v8.12,34.11
  Bottom 0.152: U2.6 10.19,55.7 8.92,54.44 8.92,52.21 v10.19,50.94
IO34  (via drill 0.35)
  Top 0.152: IC1.29 9.87,27.13 2.25,34.75 JP1.3 | v13.04,49.51 13.11,49.58 LED4.A
  Route2 0.152: JP1.3 5.9,34.75 8.12,32.53 8.92,32.53 9.23,32.84 v9.23,33
  Route15 0.152: v9.23,33 9.23,45.7 v13.04,49.51
IO35  (via drill 0.35)
  Top 0.152: IC1.31 7.13,23.36 5.11,25.38 5.11,27.13 JP1.2 3.2,32.21 v5.58,29.83 | LED3.A 20.19,51.57 v20.19,50.94
  Route15 0.152: v20.19,50.94 17.33,50.94 10.19,43.8 10.19,31.57 8.44,29.83 v5.58,29.83
  Bottom 0.152: U2.3 20.35,55.7 21.62,54.44 21.62,52.37 v20.19,50.94
IO36
  Top 0.152: IC1.32 7.02,22.51 0.03,29.51 JP1.1
IO37
  Top 0.152: IC1.33 6.95,21.66 1.46,27.16 JP12.1
IO38
  Top 0.152: IC1.34 6.85,20.81 3.04,24.62 JP12.2
IO39
  Top 0.152: IC1.35 2.14,19.96 JP12.3
IO40
  Top 0.152: IC1.36 0.45,19.11 JP12.4
IO41
  Top 0.152: IC1.37 4.5,18.26 3.2,16.97 0.06,16.97 JP12.5
IO42
  Top 0.152: IC1.38 4.76,17.41 1.77,14.43 0.06,14.43 JP12.6
IO45
  Top 0.152: IC1.41 4.43,14.86 2.88,13.32 2.88,10.66 1.6,9.38 JP12.8
IO46  (via drill 0.35)
  Top 0.152: IC1.44 6.11,12.31 v5.11,13.32
N$3
  Top 0.254: R1.2 arc-90 14.19,61.64 LED1.C
N$5
  Top 0.152: R4.2 17.81,34.45 S1.A
N$8
  Top 0.152: L2.DI 19.52,66.1 L1.DO
  Top 0.254: L1.DO 19.52,66.1
N$9
  Top 0.152: L2.DO arc90 21.31,63.8 22.41,63.8 arc-90 L3.DI
N$10
  Top 0.254: L4.DI 25.67,58.01 arc90 24.79,58.88 arc-90 24.24,59.43 24.24,60.29 arc90 L3.DO
N$11
  Top 0.152: L5.DI | L5.DI 24.87,52.05
  Top 0.254: 24.87,52.05 L4.DO
N$12
  Top 0.254: 23.11,50.8 23.11,50.62 | 23.11,50.62 23.11,49.78 arc-90 21.14,47.8 | L5.DO 23.27,50.78 arc-90 23.11,50.62 | L6.DI arc-90 21.14,47.8 | 21.14,47.8
N$16
  Top 0.254: 10.81,46.9 L7.DO 10.81,46.9 | L8.DI arc90 10.81,46.9
N$17
  Top 0.254: L9.DI arc90 7.92,49.35 8.87,49.35 arc-90 L8.DO | L8.DO
N$18
  Top 0.254: L10.DI 4.87,54.67 arc90 5.74,53.8 arc-90 6.53,53.01 L9.DO | L9.DO arc90 L9.DO
N$19
  Top 0.254: L10.DO 5.67,60.78 | 5.67,60.78 5.67,60.94 | L11.DI 5.78,60.9 arc-90 5.67,60.78
N$20
  Top 0.254: L11.DO arc90 8.28,63.05 8.28,64.07 arc-90 L12.DI | L12.DI | L11.DO arc-90 L11.DO
N$21
  Top 0.254: R5.2 18.09,60.34 arc-90 LED2.C
N$22
  Top 0.254: R6.2 20.03,54.28 arc-90 LED3.C
N$23
  Top 0.254: R7.2 arc-90 16.98,51.67 LED4.C
N$24
  Top 0.254: R8.2 12.44,52.34 arc-90 LED5.C
N$25
  Top 0.254: R10.2 10.51,58.4 arc-90 LED6.C
N$135
  Top 0.254: L7.DI 17.09,46.1 arc90 17.81,46.81 arc-90 18.85,47.86 L6.DO | L6.DO arc-90 L6.DO
USB+5V  (via drill 0.35)
  Top 0.152: J1.1 16.57,68.22 17.33,67.45 v18.28,67.45 22.41,67.45 26.38,63.48 26.38,63.64 JP5.8 26.42,63.68 R9.2 26.38,63.42
  Route15 0.152: JP3.4 2.73,60.31 5.11,60.31 12.25,67.45 v18.28,67.45
USB_D+  (via drill 0.35)
  Top 0.152: J1.3 15.27,68.25 14.95,67.93 8.44,67.93 3.2,62.69 JP3.6 | IC1.24 14.12,27.41 v14.31,27.61
  Route2 0.152: v14.31,27.61 12.25,29.67 12.25,36.5 4.47,44.27 4.47,60.31 2.09,62.69 JP3.6
USB_D-  (via drill 0.35)
  Top 0.152: JP3.5 1.14,60.15 8.6,67.61 15.32,67.61 15.92,68.2 J1.2 | IC1.23 14.97,26.83 v15.74,27.61
  Route2 0.152: v15.74,27.61 14.79,26.65 14,26.65 11.77,28.88 11.77,36.34 4,44.12 4,59.04 2.88,60.15 JP3.5
USB_ID
  Top 0.152: JP3.7 5.27,65.23 8.28,68.25 14.33,68.25 14.62,68.54 J1.4
VCC  (via drill 0.35)
  Top 0.152: C3.2 IC2.2 IC2.4 21.62,39.76 v21.62,36.02 21.62,30.3 27.01,24.91 27.01,23.32 25.11,21.42 C1.2 R2.2 23.84,15.06 23.84,13.95 23.05,13.16 IC1.3
  Bottom 0.152: R11.1 24.16,44.59 24.16,42.37 21.62,39.83 v21.62,36.02 14,36.02 12.09,37.92 12.09,43.01 14,44.91 14,50.94 C5.1 14.32,52.21 13.36,53.16 13.36,57.61 12.73,58.24 U2.8
VDD
  pour Top (isolate 0.305, rank 2): 15.27,66.18 arc90 5.74,56.66 5.74,56.5 5.74,56.34 arc90 15.27,46.81 arc90 24.95,56.5 arc90

### Text on the board
tNames: 33 | USB+5V | ID | +5V | 15 | D+ | D- | 14 | 5V | 13 | N/C | 12 | 15 | 11 | 16 | 10 | 17 | 18 | 21 | 26 | 33 | 34 | Uncertainty Device / 2024-09-18 | 35 | 36 | 37 | 8 | 38 | 7 | 39 | 6 | 40 | 5 | 41 | 4 | 42 | Boot | EN | GND | GND | 45
bNames: GND | USB+5V | ID | +5V | D+ | 15 | D- | 14 | 5V | 13 | Uncertainty Device / 2024-09-18 | N/C | 12 | 15 | 11 | 16 | 10 | +5V | 17 | VCC | 18 | 21 | 26 | 33 | 34 | 35 | 36 | 37 | 8 | 38 | 7 | 39 | 6 | 40 | 5 | 41 | 4 | 42 | Boot | EN | GND | GND | 45